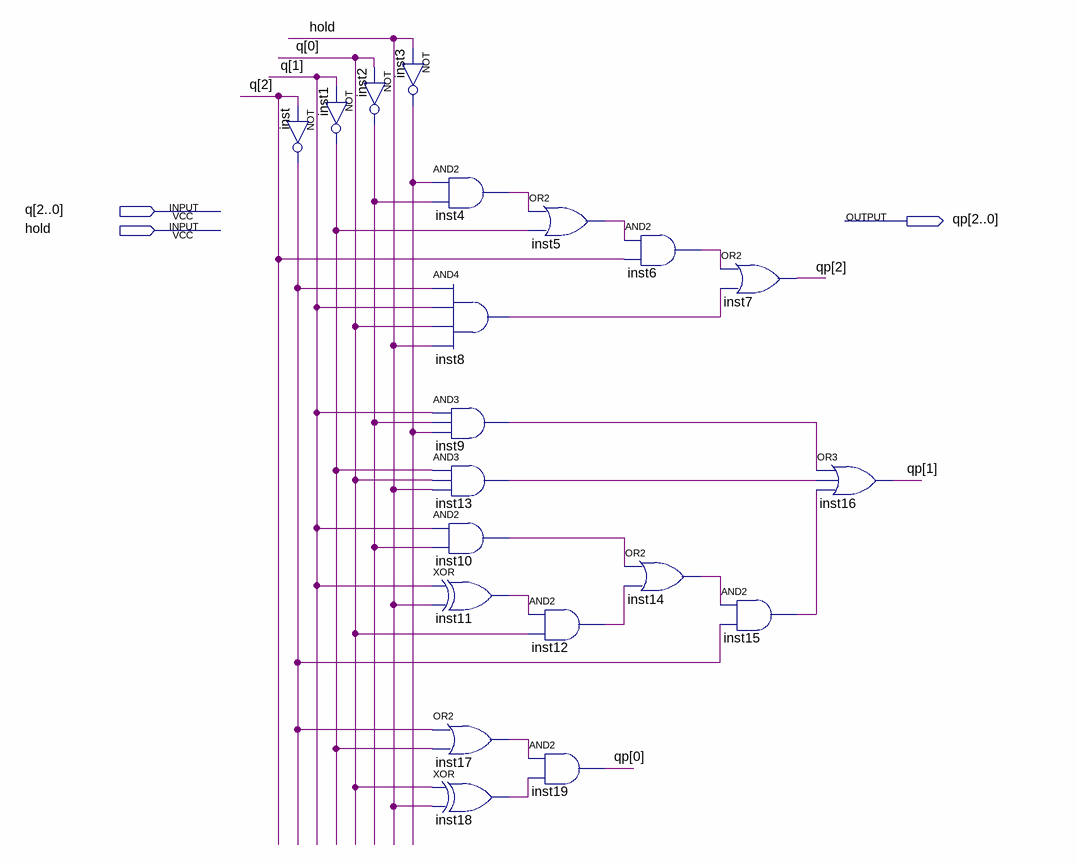
[diagram p0: schematic sheet]
// Quartus schematic update.bdf as structural Verilog: 20 symbols, 3 pins
module update (
  input  [2:0] q,
  input  hold,
  output [2:0] qp
);

  wire inst1_out, inst2_out, inst3_out, inst4_out, inst5_out, inst6_out, inst8_out, inst9_out, inst10_out,
       inst11_out, inst12_out, inst13_out, inst14_out, inst15_out, inst17_out, inst18_out, inst_out;

  not inst (inst_out, q[2]);
  not inst2 (inst2_out, q[0]);
  not inst1 (inst1_out, q[1]);
  not inst3 (inst3_out, hold);
  and inst4 (inst4_out, inst3_out, inst2_out);
  and inst8 (inst8_out, inst_out, q[1], q[0], hold);
  and inst9 (inst9_out, q[1], inst2_out, inst3_out);
  and inst13 (inst13_out, inst1_out, q[0], hold);
  and inst10 (inst10_out, q[1], inst2_out);
  xor inst11 (inst11_out, q[1], hold);
  or inst17 (inst17_out, inst_out, inst1_out);
  xor inst18 (inst18_out, q[0], hold);
  or inst5 (inst5_out, inst4_out, inst1_out);
  and inst12 (inst12_out, inst11_out, q[0]);
  and inst19 (qp[0], inst17_out, inst18_out);
  and inst6 (inst6_out, inst5_out, q[2]);
  or inst14 (inst14_out, inst10_out, inst12_out);
  or inst7 (qp[2], inst6_out, inst8_out);
  and inst15 (inst15_out, inst14_out, inst_out);
  or inst16 (qp[1], inst9_out, inst13_out, inst15_out);
endmodule
